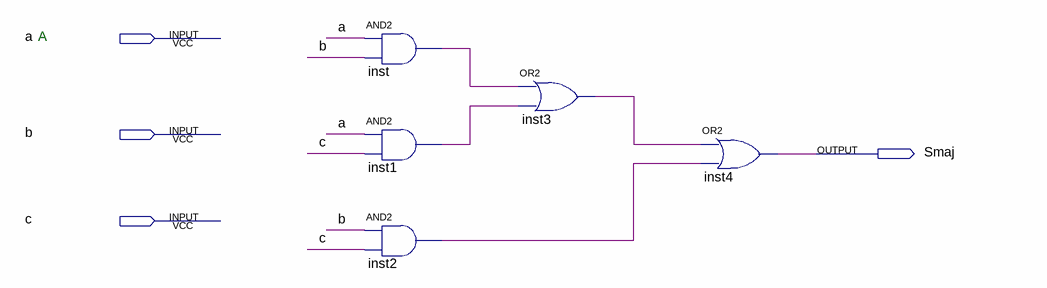
[diagram p0: schematic sheet]
// Quartus schematic majority_3bits.bdf as structural Verilog: 5 symbols, 4 pins
module majority_3bits (
  input  a,
  input  b,
  input  c,
  output Smaj
);

  wire inst1_out, inst2_out, inst3_out, inst_out;

  and inst (inst_out, a, b);
  and inst1 (inst1_out, a, c);
  and inst2 (inst2_out, b, c);
  or inst3 (inst3_out, inst_out, inst1_out);
  or inst4 (Smaj, inst3_out, inst2_out);

  // Notes on the sheet:
  //   A
endmodule
